# EAGLE design 02_MonitorStage_v1 (EAGLE 9.5.2)

## Sheet 1 of 2
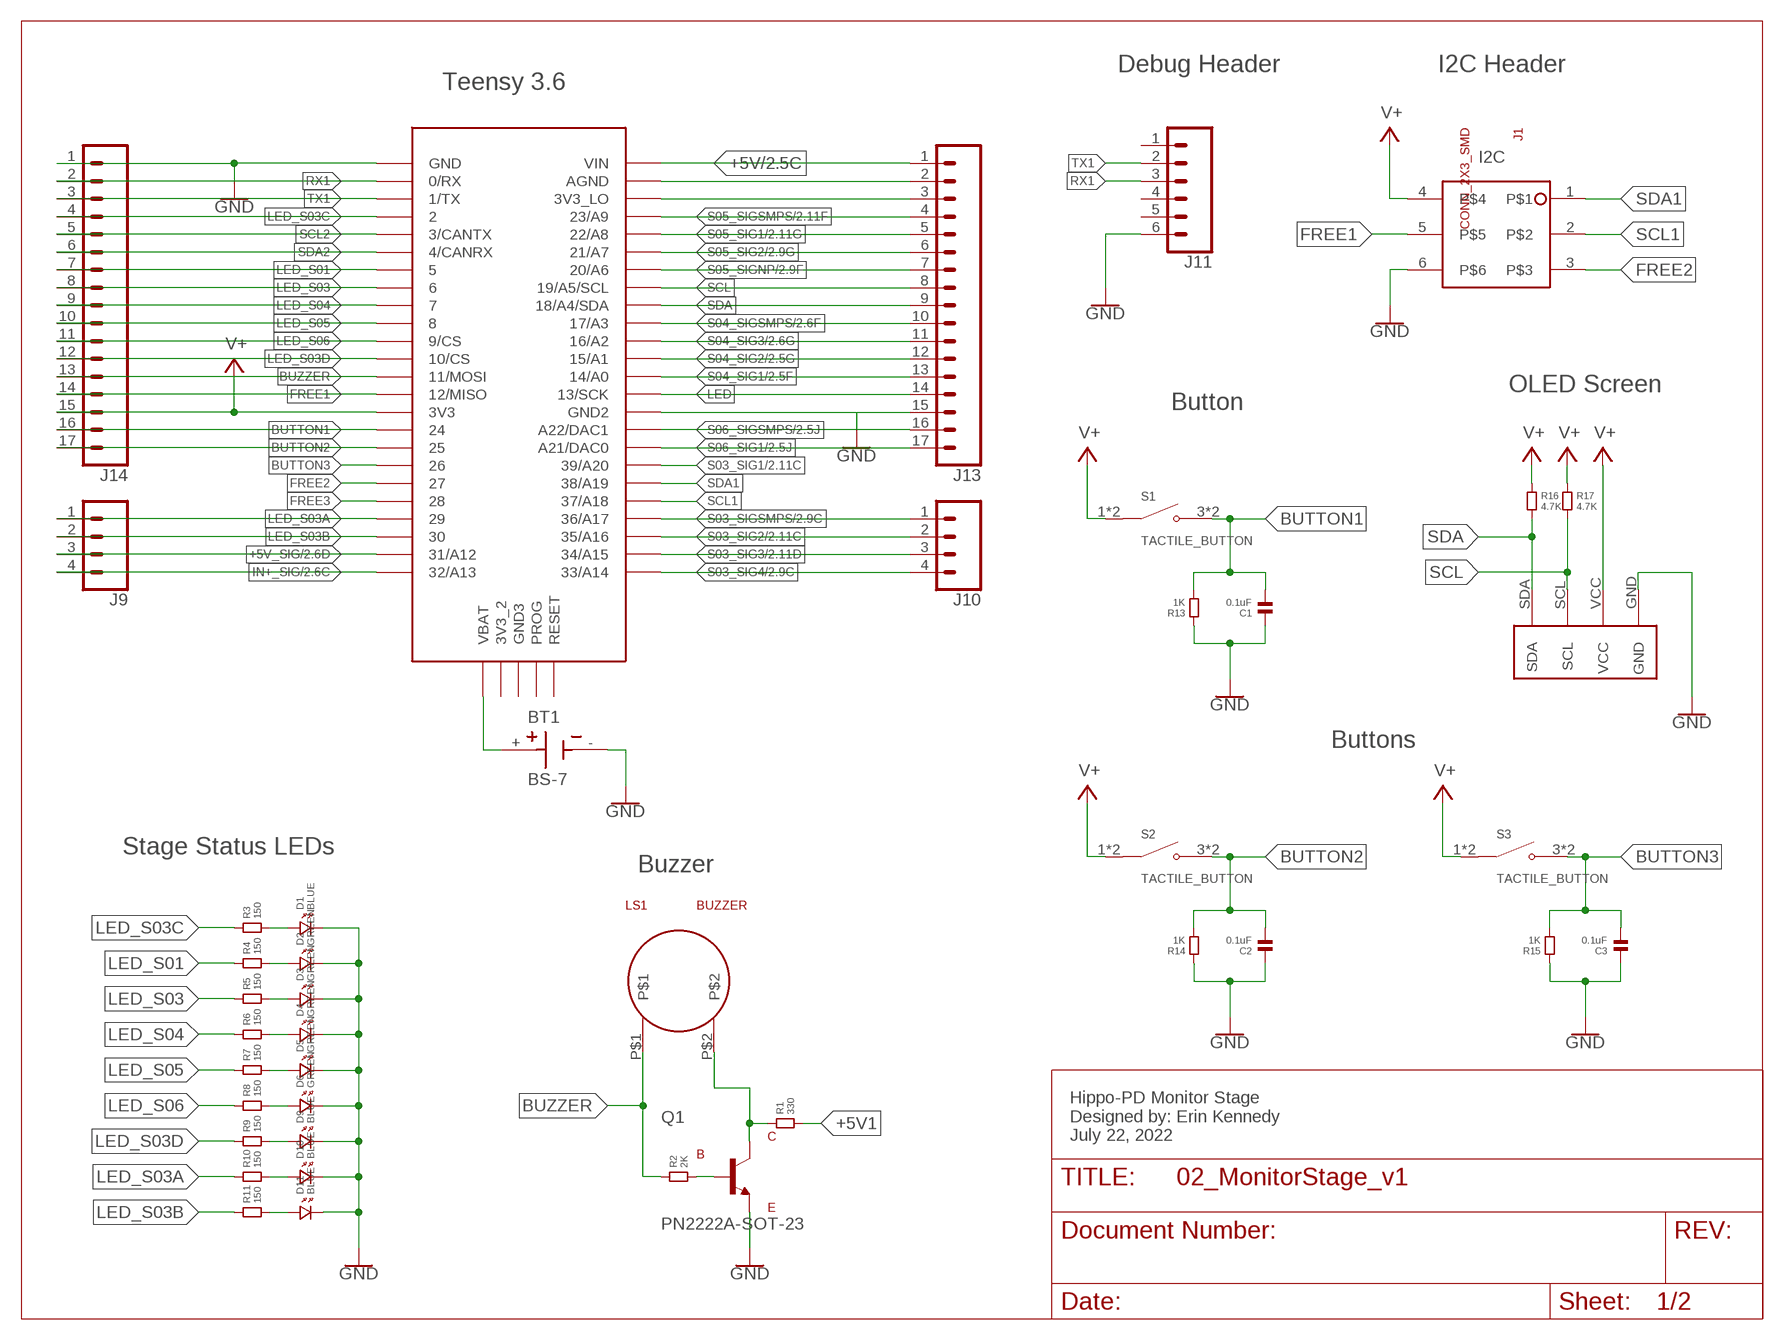
[diagram p0: schematic, sheet 1]

### Parts
BT1  BS-7  [BAT_BS-7]
C1  0.1uF  CAPACITOR.1206  [1206]
C2  0.1uF  CAPACITOR.1206  [1206]
C3  0.1uF  CAPACITOR.1206  [1206]
D1  BLUE  LED.1206  [1206.LED]
D2  GREEN  LED.1206  [1206.LED]
D3  GREEN  LED.1206  [1206.LED]
D4  GREEN  LED.1206  [1206.LED]
D5  GREEN  LED.1206  [1206.LED]
D6  GREEN  LED.1206  [1206.LED]
D9  BLUE  LED.1206  [1206.LED]
D10  BLUE  LED.1206  [1206.LED]
D11  BLUE  LED.1206  [1206.LED]
J1  CONN_2X3_SMD  [2X3_SMD_CONNECTOR]
J9  CONN_04  [1X04]
J10  CONN_04  [1X04]
J11  CONN_06  [1X06-SMD_RA_MALE_NO_HOLES]
J13  CONN_17  [1X17]
J14  CONN_17  [1X17]
LS1  BUZZER  [BUZZER]
Q1  PN2222A-SOT-23  [PN2222A-SOT-23]
R1  330  RESISTOR.1206  [1206]
R2  2K  RESISTOR.1206  [1206]
R3  150  RESISTOR.1206  [1206]
R4  150  RESISTOR.1206  [1206]
R5  150  RESISTOR.1206  [1206]
R6  150  RESISTOR.1206  [1206]
R7  150  RESISTOR.1206  [1206]
R8  150  RESISTOR.1206  [1206]
R9  150  RESISTOR.1206  [1206]
R10  150  RESISTOR.1206  [1206]
R11  150  RESISTOR.1206  [1206]
R13  1K  RESISTOR.1206  [1206]
R14  1K  RESISTOR.1206  [1206]
R15  1K  RESISTOR.1206  [1206]
R16  4.7K  RESISTOR.1206  [1206]
R17  4.7K  RESISTOR.1206  [1206]
S1  TACTILE_BUTTON  [TACTILE_BUTTON]
S2  TACTILE_BUTTON  [TACTILE_BUTTON]
S3  TACTILE_BUTTON  [TACTILE_BUTTON]
U1  TEENSY_3.5/3.6  [TEENSY_3.5/3.6]
U2  TINYSCREEN  [TINYSCREEN]

### Nets
+5V: J13.1 U1.VIN ; also sheet 2
+5V1: R1.2
+5V_SIG: J9.3 U1.31/A12 ; also sheet 2
BUTTON1: C1.2 J14.16 R13.2 S1.3(NO) S1.4(NO) U1.24
BUTTON2: C2.2 J14.17 R14.2 S2.3(NO) S2.4(NO) U1.25
BUTTON3: C3.2 R15.2 S3.3(NO) S3.4(NO) U1.26
BUZZER: J14.13 LS1.P$1 R2.1 U1.11/MOSI
FREE1: J1.5 J14.14 U1.12/MISO
FREE2: J1.3 U1.27
FREE3: U1.28
GND: BT1.- C1.1 C2.1 C3.1 D1.P$2 D2.P$2 D3.P$2 D4.P$2 D5.P$2 D6.P$2 D9.P$2 D10.P$2 D11.P$2 J1.6 J11.6 J13.15 J14.1 Q1.EMITTER R13.1 R14.1 R15.1 U1.GND U1.GND2 U2.GND ; also sheet 2
IN+_SIG: J9.4 U1.32/A13 ; also sheet 2
LED: J13.14 U1.13/SCK
LED_S01: J14.7 R4.1 U1.5
LED_S03: J14.8 R5.1 U1.6
LED_S03A: J9.1 R10.1 U1.29
LED_S03B: J9.2 R11.1 U1.30
LED_S03C: J14.4 R3.1 U1.2
LED_S03D: J14.12 R9.1 U1.10/CS
LED_S04: J14.9 R6.1 U1.7
LED_S05: J14.10 R7.1 U1.8
LED_S06: J14.11 R8.1 U1.9/CS
N$1: BT1.+ U1.VBAT
N$2: D1.P$1 R3.2
N$3: D2.P$1 R4.2
N$4: J13.2 U1.AGND
N$5: D3.P$1 R5.2
N$7: D4.P$1 R6.2
N$8: D5.P$1 R7.2
N$9: D6.P$1 R8.2
N$10: D9.P$1 R9.2
N$11: D10.P$1 R10.2
N$12: D11.P$1 R11.2
N$13: LS1.P$2 Q1.COLLECTOR R1.1
N$14: J13.3 U1.3V3_LO
N$23: Q1.BASE R2.2
RX1: J11.3 J14.2 U1.0/RX
S03_SIG1: U1.39/A20 ; also sheet 2
S03_SIG2: J10.2 U1.35/A16 ; also sheet 2
S03_SIG3: J10.3 U1.34/A15 ; also sheet 2
S03_SIG4: J10.4 U1.33/A14 ; also sheet 2
S03_SIGSMPS: J10.1 U1.36/A17 ; also sheet 2
S04_SIG1: J13.13 U1.14/A0 ; also sheet 2
S04_SIG2: J13.12 U1.15/A1 ; also sheet 2
S04_SIG3: J13.11 U1.16/A2 ; also sheet 2
S04_SIGSMPS: J13.10 U1.17/A3 ; also sheet 2
S05_SIG1: J13.5 U1.22/A8 ; also sheet 2
S05_SIG2: J13.6 U1.21/A7 ; also sheet 2
S05_SIGNP: J13.7 U1.20/A6 ; also sheet 2
S05_SIGSMPS: J13.4 U1.23/A9 ; also sheet 2
S06_SIG1: J13.17 U1.21/DAC0(A21/DAC0) ; also sheet 2
S06_SIGSMPS: J13.16 U1.A22/DAC1 ; also sheet 2
SCL: J13.8 R17.2 U1.19/A5/SCL U2.SCL
SCL1: J1.2 U1.37/A18
SCL2: J14.5 U1.3/CANTX
SDA: J13.9 R16.2 U1.18/A4/SDA U2.SDA
SDA1: J1.1 U1.38/A19
SDA2: J14.6 U1.4/CANRX
TX1: J11.2 J14.3 U1.1/TX
V+: J1.4 J14.15 R16.1 R17.1 S1.1(COM) S1.2(COM) S2.1(COM) S2.2(COM) S3.1(COM) S3.2(COM) U1.3V3 U2.VCC
Unconnected: J11.1 J11.4 J11.5 U1.3V3_2 U1.GND3 U1.PROG U1.RESET

### Notes on the sheet
- Debug Header | I2C Header
- Teensy 3.6
- I2C
- OLED Screen
- Button
- Buttons
- Stage Status LEDs
- Buzzer
- Hippo-PD Monitor Stage
  Designed by: Erin Kennedy
  July 22, 2022

## Sheet 2 of 2
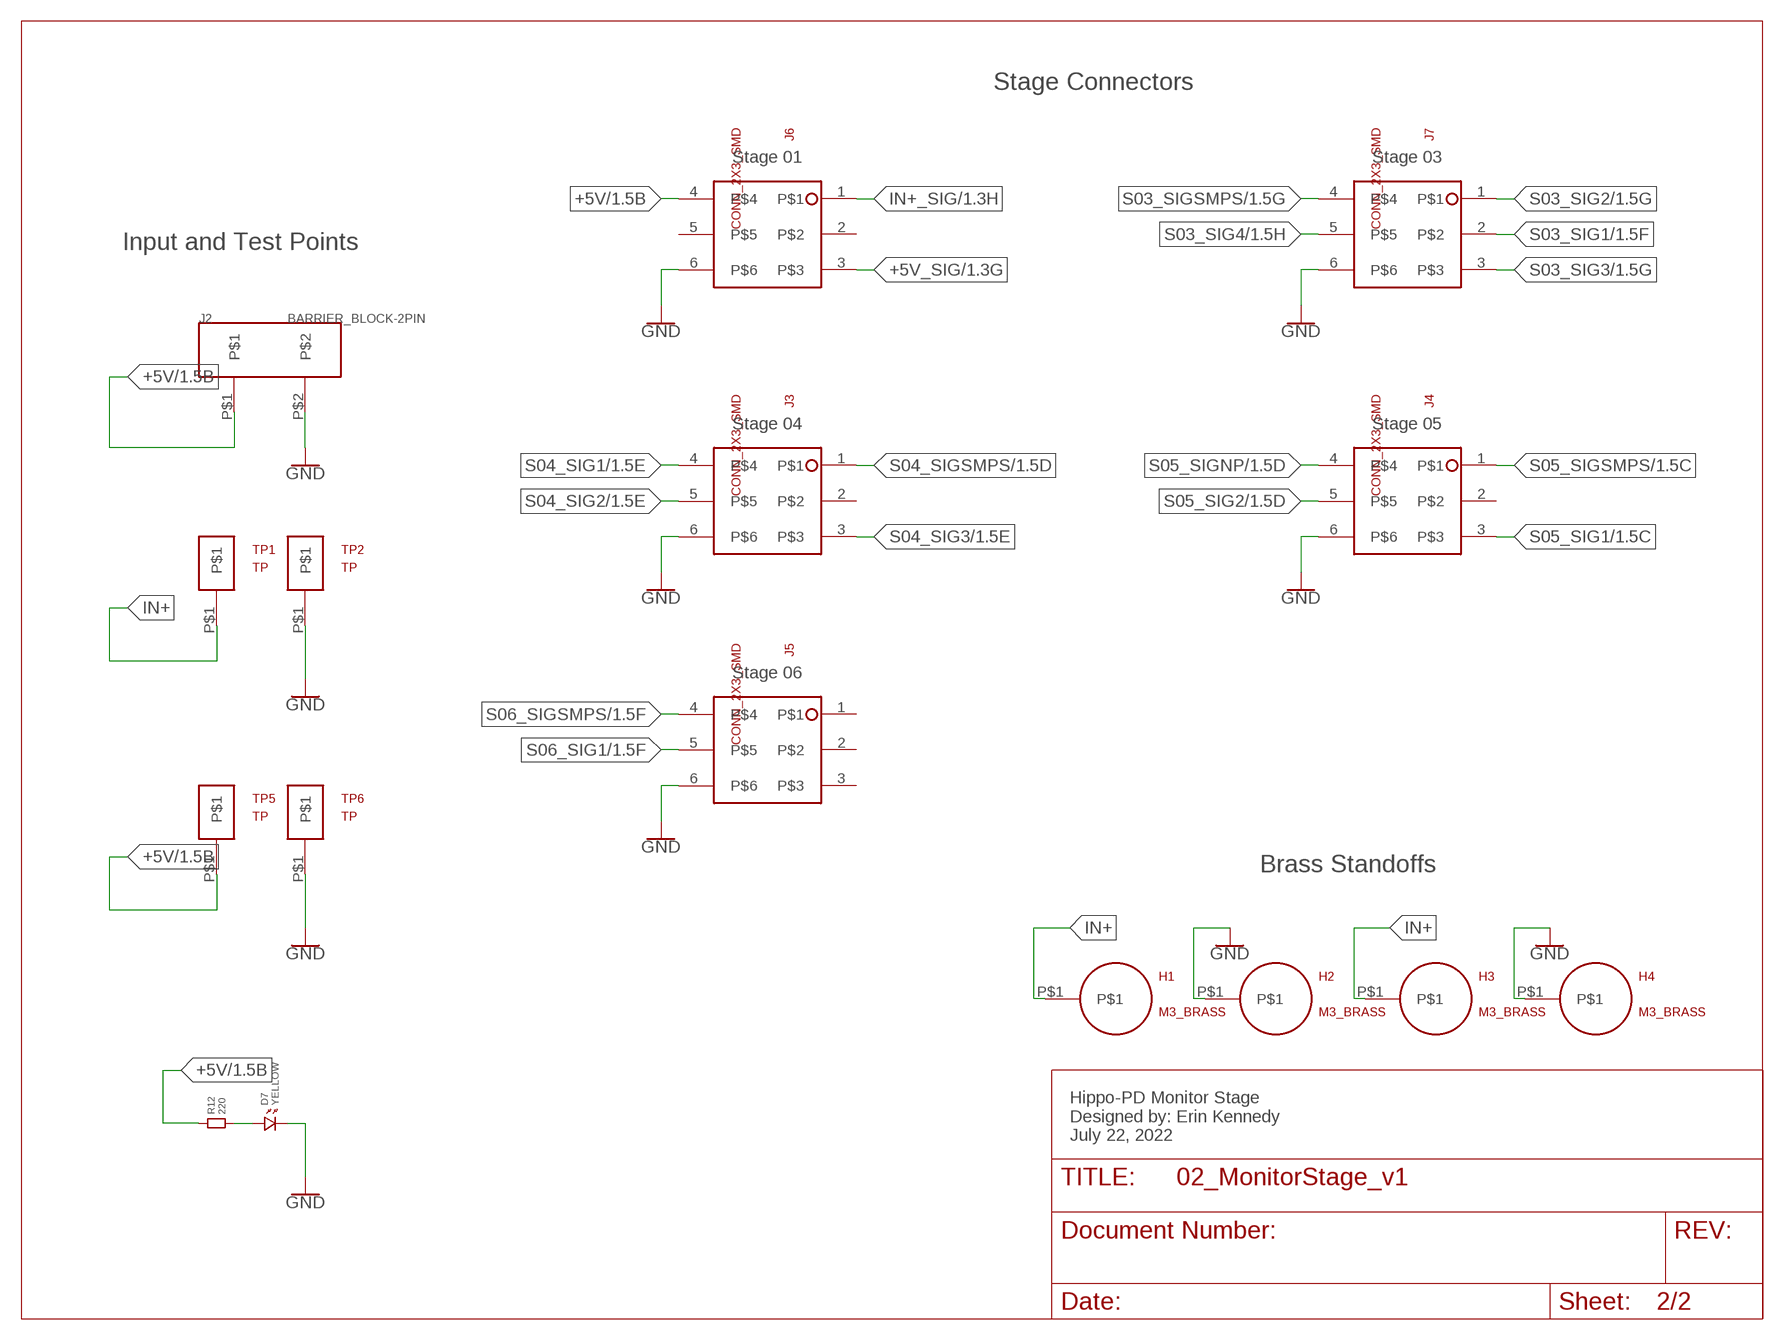
[diagram p1: schematic, sheet 2]

### Parts
D7  YELLOW  LED.1206  [1206.LED]
H1  M3_BRASS  [M3_BRASS]
H2  M3_BRASS  [M3_BRASS]
H3  M3_BRASS  [M3_BRASS]
H4  M3_BRASS  [M3_BRASS]
J2  BARRIER_BLOCK-2PIN  [BARRIERBLOCK-2PIN]
J3  CONN_2X3_SMD  [2X3_SMD_CONNECTOR]
J4  CONN_2X3_SMD  [2X3_SMD_CONNECTOR]
J5  CONN_2X3_SMD  [2X3_SMD_CONNECTOR]
J6  CONN_2X3_SMD  [2X3_SMD_CONNECTOR]
J7  CONN_2X3_SMD  [2X3_SMD_CONNECTOR]
R12  220  RESISTOR.1206  [1206]
TP1  TP  [TP]
TP2  TP  [TP]
TP5  TP  [TP]
TP6  TP  [TP]

### Nets
+5V: J2.P$1 J6.4 R12.1 TP5.P$1 ; also sheet 1
+5V_SIG: J6.3 ; also sheet 1
GND: D7.P$2 H2.P$1 H4.P$1 J2.P$2 J3.6 J4.6 J5.6 J6.6 J7.6 TP2.P$1 TP6.P$1 ; also sheet 1
IN+: H1.P$1 H3.P$1 TP1.P$1
IN+_SIG: J6.1 ; also sheet 1
N$6: D7.P$1 R12.2
S03_SIG1: J7.2 ; also sheet 1
S03_SIG2: J7.1 ; also sheet 1
S03_SIG3: J7.3 ; also sheet 1
S03_SIG4: J7.5 ; also sheet 1
S03_SIGSMPS: J7.4 ; also sheet 1
S04_SIG1: J3.4 ; also sheet 1
S04_SIG2: J3.5 ; also sheet 1
S04_SIG3: J3.3 ; also sheet 1
S04_SIGSMPS: J3.1 ; also sheet 1
S05_SIG1: J4.3 ; also sheet 1
S05_SIG2: J4.5 ; also sheet 1
S05_SIGNP: J4.4 ; also sheet 1
S05_SIGSMPS: J4.1 ; also sheet 1
S06_SIG1: J5.5 ; also sheet 1
S06_SIGSMPS: J5.4 ; also sheet 1
Unconnected: J3.2 J4.2 J5.1 J5.2 J5.3 J6.2 J6.5

### Notes on the sheet
- Stage Connectors
- Stage 01 | Stage 03
- Input and Test Points
- Stage 04 | Stage 05
- Stage 06
- Brass Standoffs
- Hippo-PD Monitor Stage
  Designed by: Erin Kennedy
  July 22, 2022

## Library data of the parts
BT1 = Hippo-PS:BS-7: BATTERY HOLDER COIN 20MM PC PIN Check availability <https://pricing.snapeda.com/parts/BS-7/MPD%20%28Memory/view-part?ref=eda>; AVAILABILITY: In Stock; DESCRIPTION: BATTERY HOLDER COIN 20MM PC PIN; MF: MPD (Memory; MP: BS-7; PACKAGE: None; PRICE: None; PURCHASE-URL: https://pricing.snapeda.com/search/part/BS-7/?ref=eda
C1-C3 = standardparts:CAPACITOR
D1-D7 D9-D11 = standardparts:LED
H1-H4 = Hippo-PS:M3_BRASS
J1 J3-J7 = Hippo-PS:CONN_2X3_SMD
J2 = Hippo-PS:BARRIER_BLOCK-2PIN: Barrier block connector Digikey #ED2946-ND
J9 J10 = SparkFun-Connectors:CONN_04: Multi connection point. Often used as Generic Header-pin footprint for 0.1 inch spaced/style header connections On any of the 0.1 inch spaced packages, you can populate with these: Break Away Headers - Straight <https://www.sparkfun.com/products/116> (PRT-00116) Break Away Male Headers - Right Angle <https://www.sparkfun.com/products/553> (PRT-00553) Female Headers <https://www.sparkfun.com/products/115> (PRT-00115) Break Away Headers - Machine Pin <https://www.sparkfun.com/products/117> (PRT-00117) Break Away Female Headers - Swiss Machine Pin <https://www.sparkfun.com/products/743> (PRT-00743) For SCREWTERMINALS and SPRING TERMINALS visit here: Screw Terimnals on SparkFun.com <https://www.sparkfun.com/search/results?term=Screw+Terminals> (5mm/3.5mm/2.54mm spacing) This device is also useful as a general connection point to wire up your design to another part of your project. Our various solder wires solder well into these plated through hole pads. Hook-Up Wire - Assortment (Stranded, 22 AWG) <https://www.sparkfun.com/products/11375> (PRT-11375) Hook-Up Wire - Assortment (Solid Core, 22 AWG) <https://www.sparkfun.com/products/11367> (PRT-11367) View the entire wire category on our website here <https://www.sparkfun.com/categories/141> Special notes: Molex polarized connector foot print use with SKU : PRT-08231 with associated crimp pins and housings. 1MM SMD Version SKU: PRT-10208; PROD_ID: CONN-09696
J11 = Hippo-PS:CONN_06: Multi connection point. Often used as Generic Header-pin footprint for 0.1 inch spaced/style header connections On any of the 0.1 inch spaced packages, you can populate with these: Break Away Headers - Straight <https://www.sparkfun.com/products/116> (PRT-00116) Break Away Male Headers - Right Angle <https://www.sparkfun.com/products/553> (PRT-00553) Female Headers <https://www.sparkfun.com/products/115> (PRT-00115) Break Away Headers - Machine Pin <https://www.sparkfun.com/products/117> (PRT-00117) Break Away Female Headers - Swiss Machine Pin <https://www.sparkfun.com/products/743> (PRT-00743) Arduino Stackable Header - 6 Pin <https://www.sparkfun.com/products/9280> (PRT-09280) For SCREWTERMINALS and SPRING TERMINALS visit here: Screw Terimnals on SparkFun.com <https://www.sparkfun.com/search/results?term=Screw+Terminals> (5mm/3.5mm/2.54mm spacing) This device is also useful as a general connection point to wire up your design to another part of your project. Our various solder wires solder well into these plated through hole pads. Hook-Up Wire - Assortment (Stranded, 22 AWG) <https://www.sparkfun.com/products/11375> (PRT-11375) Hook-Up Wire - Assortment (Solid Core, 22 AWG) <https://www.sparkfun.com/products/11367> (PRT-11367) View the entire wire category on our website here <https://www.sparkfun.com/categories/141>
J13 J14 = SparkFun-Connectors:CONN_17: Multi connection point. Often used as Generic Header-pin footprint for 0.1 inch spaced/style header connections On any of the 0.1 inch spaced packages, you can populate with these: Break Away Headers - Straight <https://www.sparkfun.com/products/116> (PRT-00116) Break Away Male Headers - Right Angle <https://www.sparkfun.com/products/553> (PRT-00553) Female Headers <https://www.sparkfun.com/products/115> (PRT-00115) Break Away Headers - Machine Pin <https://www.sparkfun.com/products/117> (PRT-00117) Break Away Female Headers - Swiss Machine Pin <https://www.sparkfun.com/products/743> (PRT-00743) For SCREWTERMINALS and SPRING TERMINALS visit here: Screw Terimnals on SparkFun.com <https://www.sparkfun.com/search/results?term=Screw+Terminals> (5mm/3.5mm/2.54mm spacing) This device is also useful as a general connection point to wire up your design to another part of your project. Our various solder wires solder well into these plated through hole pads. Hook-Up Wire - Assortment (Stranded, 22 AWG) <https://www.sparkfun.com/products/11375> (PRT-11375) Hook-Up Wire - Assortment (Solid Core, 22 AWG) <https://www.sparkfun.com/products/11367> (PRT-11367) View the entire wire category on our website here <https://www.sparkfun.com/categories/141> Special notes: Molex polarized connector foot print use with SKU : PRT-08231 with associated crimp pins and housings. 1MM SMD Version SKU: PRT-10208 NOTES ON THE VARIANTS LOCK and LOCK_LONGPADS... This footprint was designed to help hold the alignment of a through-hole component (i.e. 6-pin header) while soldering it into place. You may notice that each hole has been shifted either up or down by 0.005 of an inch from it's more standard position (which is a perfectly straight line). This slight alteration caused the pins (the squares in the middle) to touch the edges of the holes. Because they are alternating, it causes a "brace" to hold the component in place. 0.005 has proven to be the perfect amount of "off-center" position when using our standard breakaway headers. Although looks a little odd when you look at the bare footprint, once you have a header in there, the alteration is very hard to notice. Also,if you push a header all the way into place, it is covered up entirely on the bottom side.
LS1 = Hippo-PS:BUZZER
Q1 = Hippo-PS:PN2222A-SOT-23: MMBT3904 series 40V 200mA SOT23 NPN Switching Transistor Check availability <https://pricing.snapeda.com/parts/MMBT3904%2C215/Nexperia%20USA/view-part?ref=eda>; AVAILABILITY: In Stock; DESCRIPTION: Bipolar (BJT) Transistor NPN 40 V 200 mA 300MHz 250 mW Surface Mount TO-236AB; MF: Nexperia USA; MP: MMBT3904,215; PACKAGE: SOT23-3 Nexperia USA Inc.; PRICE: None; PURCHASE-URL: https://pricing.snapeda.com/search/part/MMBT3904,215/?ref=eda
R1-R17 = standardparts:RESISTOR
S1-S3 = Hippo-PS:TACTILE_BUTTON: Tactile Switch SPST-NO Top Actuated Surface Mount Check availability <https://pricing.snapeda.com/parts/PTS526%20SM08%20SMTR2%20LFS/C%26K/view-part?ref=eda>; AVAILABILITY: In Stock; DESCRIPTION: Tactile Switch SPST-NO Top Actuated Surface Mount; MF: C&K; MP: PTS526 SM08 SMTR2 LFS; PACKAGE: None; PRICE: None; PURCHASE-URL: https://pricing.snapeda.com/search/part/PTS526 SM08 SMTR2 LFS/?ref=eda
TP1 TP2 TP5 TP6 = Hippo-PS:TP
U1 = Hippo-PS:TEENSY_3.5/3.6
U2 = Hippo-PS:TINYSCREEN

## Board
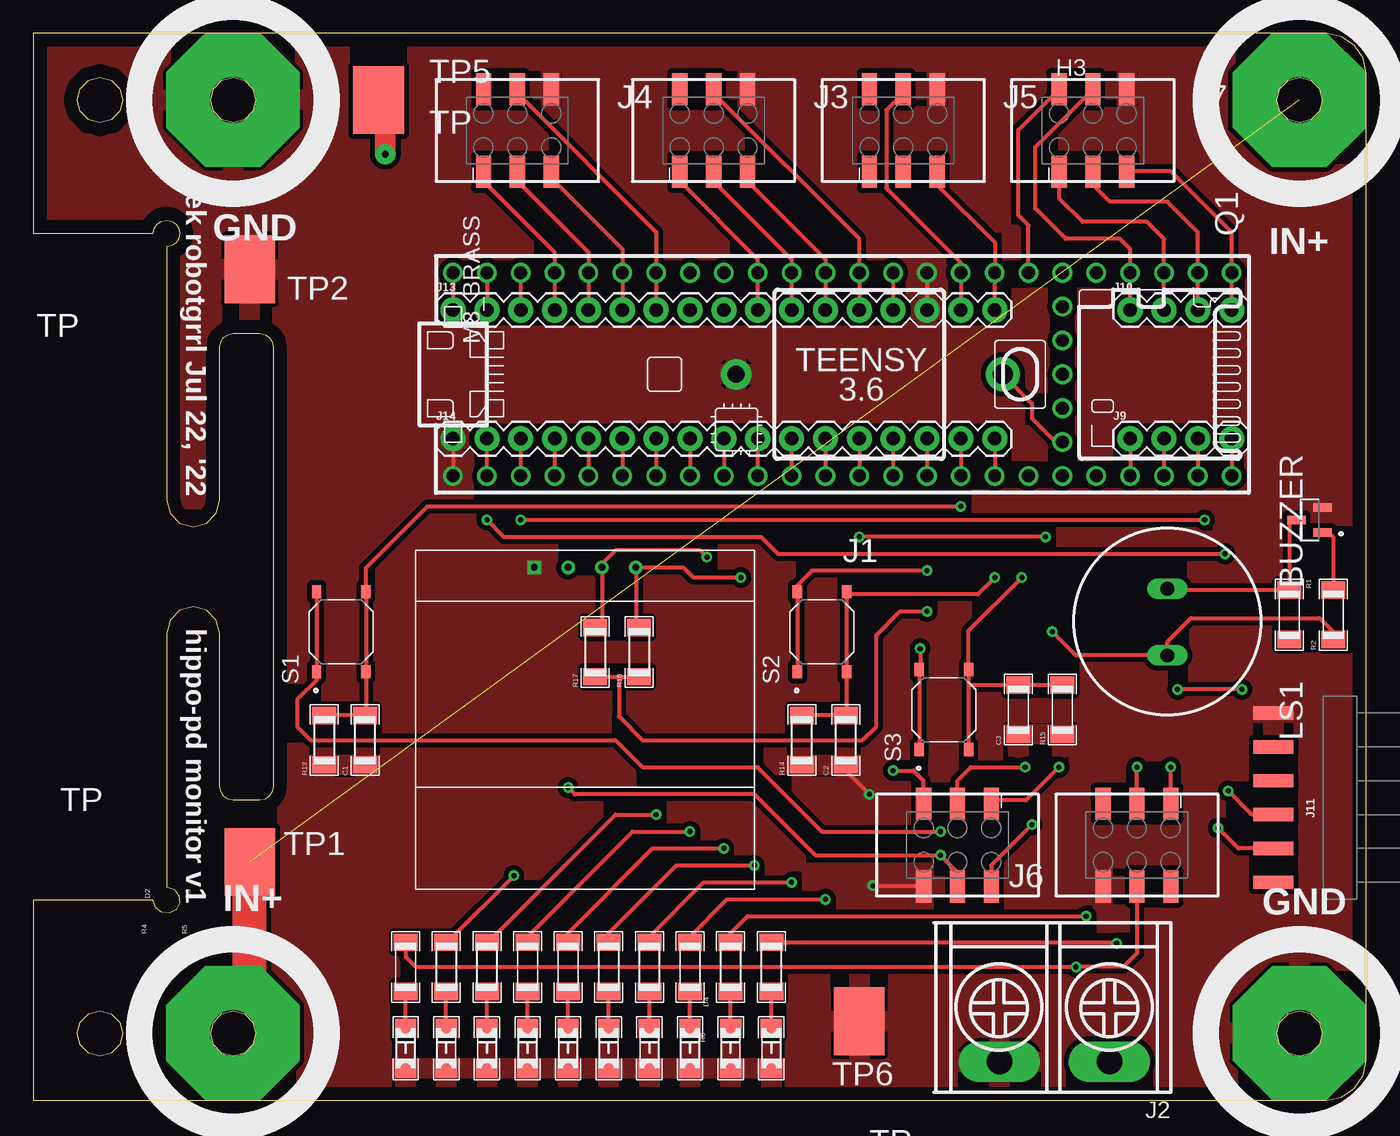
[diagram p2: board, top side]
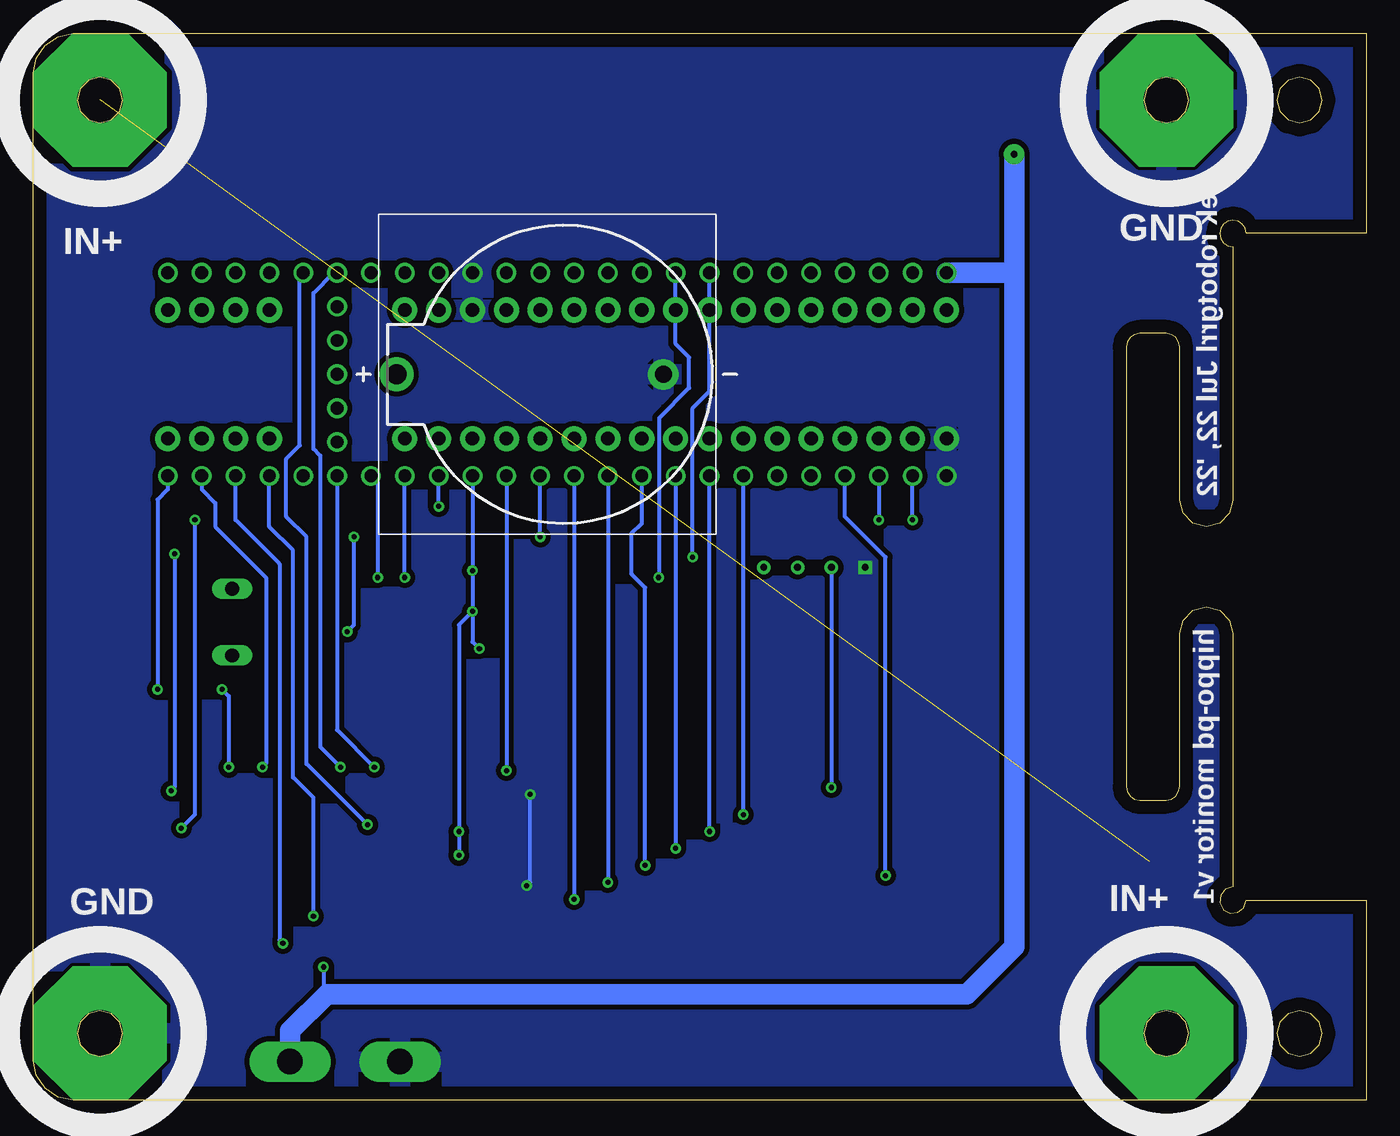
[diagram p3: board, bottom side, seen from below]

Size 100 x 80 mm. Coordinates in mm from the lower left corner, seen from the top.
Outline: 100,77 99.77,78.15 99.12,79.12 98.15,79.77 97,80 0,80 0,65 9,65 9.08,65.39 9.29,65.71 9.61,65.92 10,66 10.39,65.92 10.71,65.71 10.92,65.39 11,65 10.92,64.61 10.71,64.29 10.39,64.08 10,64 10,45 10.27,44 11,43.27 12,43 13,43.27 13.73,44 14,45 14,56.5 14.08,56.89 14.29,57.21 14.61,57.42 15,57.5 17,57.5 17.39,57.42 17.71,57.21 17.92,56.89 18,56.5 18,23.5 17.92,23.11 17.71,22.79 17.39,22.58 17,22.5 15,22.5 14.61,22.58 14.29,22.79 14.08,23.11 14,23.5 14,35 13.73,36 13,36.73 12,37 11,36.73 10.27,36 10,35 10,16 10.56,15.83 10.92,15.38 10.98,14.8 10.71,14.29 10.2,14.02 9.62,14.08 9.17,14.44 9,15 0,15 0,0 97,0 98.15,0.23 99.12,0.88 99.77,1.85 100,3 100,77
Outline: 6.7,75 6.47,74.15 5.85,73.53 5,73.3 4.15,73.53 3.53,74.15 3.3,75 3.53,75.85 4.15,76.47 5,76.7 5.85,76.47 6.47,75.85 6.7,75
Outline: 96.7,75 96.47,74.15 95.85,73.53 95,73.3 94.15,73.53 93.53,74.15 93.3,75 93.53,75.85 94.15,76.47 95,76.7 95.85,76.47 96.47,75.85 96.7,75
Outline: 96.7,5 96.47,4.15 95.85,3.53 95,3.3 94.15,3.53 93.53,4.15 93.3,5 93.53,5.85 94.15,6.47 95,6.7 95.85,6.47 96.47,5.85 96.7,5
Outline: 16.7,75 16.47,74.15 15.85,73.53 15,73.3 14.15,73.53 13.53,74.15 13.3,75 13.53,75.85 14.15,76.47 15,76.7 15.85,76.47 16.47,75.85 16.7,75
Outline: 16.7,5 16.47,4.15 15.85,3.53 15,3.3 14.15,3.53 13.53,4.15 13.3,5 13.53,5.85 14.15,6.47 15,6.7 15.85,6.47 16.47,5.85 16.7,5
Outline: 6.7,5 6.47,4.15 5.85,3.53 5,3.3 4.15,3.53 3.53,4.15 3.3,5 3.53,5.85 4.15,6.47 5,6.7 5.85,6.47 6.47,5.85 6.7,5
Copper layers (1*16): Top 0.035mm / dielectric 1.5mm / Bottom 0.035mm
Design rules "default": minimum track width 6mil, minimum drill 0.35mm, track to track 6mil, track to pad 6mil, pad to pad 6mil, via to via 6mil, smd to smd 6mil, copper to edge 40mil, drill to drill 6mil, minimum pad ring 10mil, minimum via ring 8mil, stop-mask expansion 4mil, vias tented up to drill 0mil, thermal gap 10mil

### Footprints (pad centres in the part's own frame; a part is rotated, then mirrored left to right if it is on the bottom)
BAT_BS-7 = drill 1.5 pad 2.54: + 10,0 | drill 1.27 pad 2.286: - -10,0
1206 = smd 1.3 x 1.8: 1 -1.85,0; 2 1.85,0
1206.LED = smd 1.4 x 1.6: P$1 -1.5,0; P$2 1.5,0
M3_BRASS = drill 3.4 pad 10 octagon: P$1 0,0
2X3_SMD_CONNECTOR = smd 1.147 x 2.408: 1 -2.54,-3.104; 2 -2.54,3.104; 3 0,-3.104; 4 0,3.104; 5 2.54,-3.104; 6 2.54,3.104
BARRIERBLOCK-2PIN = drill 1.905 pad 3.048 long: P$1 4.6,10.4; P$2 12.85,10.4
1X04 = drill 1.016 pad 1.88: 1 0,0; 2 2.54,0; 3 5.08,0; 4 7.62,0
1X06-SMD_RA_MALE_NO_HOLES = smd 1 x 3: 1 -6.35,5; 2 -3.81,5; 3 -1.27,5; 4 1.27,5; 5 3.81,5; 6 6.35,5
1X17 = drill 1.016 pad 1.88: 1 0,0; 2 2.54,0; 3 5.08,0; 4 7.62,0; 5 10.16,0; 6 12.7,0; 7 15.24,0; 8 17.78,0; 9 20.32,0; 10 22.86,0; 11 25.4,0; 12 27.94,0; 13 30.48,0; 14 33.02,0; 15 35.56,0; 16 38.1,0; 17 40.64,0
BUZZER = drill 1.016 long: P$1 -2.54,0; P$2 2.46,0
PN2222A-SOT-23 = smd 0.635 x 1.397: BASE -0.95,-0.98; COLLECTOR 0,0.98; EMITTER 0.95,-0.98
TACTILE_BUTTON = smd 1 x 0.7: 1 -3,1.85; 2 3,1.85; 3 -3,-1.85; 4 3,-1.85
TP = smd 3.81 x 5.08: P$1 0,0
TEENSY_3.5/3.6 = drill 0.965: 0/RX -25.4,-7.62; 1/TX -22.86,-7.62; 2 -20.32,-7.62; 3/CANTX -17.78,-7.62; 3V3 7.62,-7.62; 3V3_2 17.78,-2.54; 3V3_LO -22.86,7.62; 4/CANRX -15.24,-7.62; 5 -12.7,-7.62; 6 -10.16,-7.62; 7 -7.62,-7.62; 8 -5.08,-7.62; 9/CS -2.54,-7.62; 10/CS 0,-7.62; 11/MOSI 2.54,-7.62; 12/MISO 5.08,-7.62; 13/SCK 5.08,7.62; 14/A0 2.54,7.62; 15/A1 0,7.62; 16/A2 -2.54,7.62; 17/A3 -5.08,7.62; 18/A4/SDA -7.62,7.62; 19/A5/SCL -10.16,7.62; 20/A6 -12.7,7.62; 21/A7 -15.24,7.62; 21/DAC0 12.7,7.62; 22/A8 -17.78,7.62; 23/A9 -20.32,7.62; 24 10.16,-7.62; 25 12.7,-7.62; 26 15.24,-7.62; 27 17.78,-7.62; 28 20.32,-7.62; 29 22.86,-7.62; 30 25.4,-7.62; 31/A12 27.94,-7.62; 32/A13 30.48,-7.62; 33/A14 30.48,7.62; 34/A15 27.94,7.62; 35/A16 25.4,7.62; 36/A17 22.86,7.62; 37/A18 20.32,7.62; 38/A19 17.78,7.62; 39/A20 15.24,7.62; A22/DAC1 10.16,7.62; AGND -25.4,7.62; GND -27.94,-7.62; GND2 7.62,7.62; GND3 17.78,0; PROG 17.78,2.54; RESET 17.78,5.08; VBAT 17.78,-5.08; VIN -27.94,7.62
TINYSCREEN = drill 0.508 pad 1.016 square: GND 8.89,24.13 | drill 0.508 pad 1.016: SCL 13.97,24.13; SDA 16.51,24.13; VCC 11.43,24.13

### Placement (x,y rotation side)
BT1  62.73,54.44 180 bottom
C1  24.88,27 90 top
C2  60.95,27 90 top
C3  73.91,29.29 90 top
D1  30.98,3.89 270 top
D2  34.03,3.89 270 top
D3  37.08,3.89 270 top
D4  40.12,3.89 270 top
D5  43.17,3.89 270 top
D6  46.22,3.89 270 top
D7  27.93,3.89 270 top
D9  49.27,3.89 270 top
D10  52.32,3.89 270 top
D11  55.36,3.89 270 top
H1  14.98,5.03 0 top
H2  94.99,5.03 0 top
H3  94.99,75.01 0 top
H4  14.98,75.01 0 top
J1  69.33,19.13 180 top
J2  85.34,13.29 180 top
J3  51.05,72.72 0 top
J4  36.31,72.72 0 top
J5  65.27,72.72 0 top
J6  82.8,19.13 180 top
J7  79.49,72.72 0 top
J9  82.29,49.61 0 top
J10  82.29,59.26 0 top
J11  98.04,22.69 90 top
J13  31.49,59.26 0 top
J14  31.49,49.61 0 top
LS1  85.08,35.89 90 top
Q1  95.75,43.51 90 top
R1  94.23,36.4 270 top
R2  97.53,36.4 90 top
R3  30.98,9.99 270 top
R4  34.03,9.99 270 top
R5  37.08,9.99 270 top
R6  40.12,9.99 270 top
R7  43.17,9.99 270 top
R8  46.22,9.99 270 top
R9  49.27,9.99 270 top
R10  52.32,9.99 270 top
R11  55.36,9.99 270 top
R12  27.93,9.99 270 top
R13  21.84,27 90 top
R14  57.65,27 90 top
R15  77.21,29.29 90 top
R16  45.46,33.61 90 top
R17  42.16,33.61 90 top
S1  23.11,35.13 90 top
S2  59.17,35.13 90 top
S3  68.32,29.29 90 top
TP1  16.25,17.86 0 top
TP2  16.25,62.31 0 top
TP5  25.9,75.01 0 top
TP6  61.97,5.92 0 top
U1  59.43,54.44 0 top
U2  28.69,15.83 0 top

### Tracks (layer width: path | path; a pad name or v marks a point on that pad's centre or on a via)
+5V  (via drill 0.38 pad 0.64, 0.51 pad 1.52)
  Top 0.305: R12.1 27.93,10.75 28.69,9.99 v78.22,9.99 81.78,9.99 82.8,11 J6.4 | U1.VIN J13.1
  Top 1.524: v26.41,70.95 26.41,74.5 TP5.P$1
  Bottom 0.305: v78.22,9.99 78.22,8.21 77.97,7.95
  Bottom 1.524: J2.P$1 80.74,5.19 77.97,7.95 29.96,7.95 26.41,11.51 26.41,62.06 | 26.41,62.06 U1.VIN | 26.41,62.06 v26.41,70.95
+5V_SIG  (via drill 0.38 pad 0.64)
  Top 0.305: J6.3 v82.8,24.97 | J9.3 U1.31/A12
  Bottom 0.305: U1.31/A12 87.37,45.8 86.35,44.78 86.35,43.01 82.54,39.2 82.54,25.23 v82.8,24.97
BUTTON1  (via drill 0.38 pad 0.64)
  Top 0.305: R13.2 C1.2 24.96,28.93 S1.3 S1.4 24.96,39.91 29.58,44.53 v69.59,44.53 | J14.16 U1.24
  Bottom 0.305: v69.59,44.53 U1.24
BUTTON2  (via drill 0.38 pad 0.64)
  Top 0.305: R14.2 C2.2 61.02,28.93 S2.3 S2.4 61.23,37.93 70.86,37.93 v72.13,39.2 | J14.17 U1.25
  Bottom 0.305: v72.13,39.2 U1.25
BUTTON3  (via drill 0.38 pad 0.64)
  Top 0.305: 70.17,31.07 S3.4 70.17,35.2 v74.16,39.2 | 70.17,31.07 S3.3 | 70.17,31.07 70.24,31.14 C3.2 R15.2
  Bottom 0.305: v74.16,39.2 74.16,46.31 U1.26
BUZZER  (via drill 0.38 pad 0.64)
  Top 0.305: R2.1 97.53,35.13 96.51,36.15 86.86,36.15 85.08,34.37 LS1.P$1 78.22,33.35 v76.45,35.13 | v75.94,42.24 v61.97,42.24 | J14.13 U1.11/MOSI
  Bottom 0.305: v76.45,35.13 75.94,35.64 v75.94,42.24 | v61.97,42.24 U1.11/MOSI
FREE1  (via drill 0.38 pad 0.64)
  Top 0.305: v64.51,24.72 66.03,24.72 66.79,23.96 J1.5 | J14.14 U1.12/MISO
  Bottom 0.305: U1.12/MISO v64.51,24.72
FREE2  (via drill 0.38 pad 0.64)
  Top 0.305: v74.41,24.97 70.35,24.97 69.33,23.96 J1.3
  Bottom 0.305: U1.27 77.21,27.77 v74.41,24.97
GND  (via drill 0.38 pad 0.64)
  Top 0.305: J1.6 63.04,16.03 v62.98,16.08 | v62.73,22.94 60.95,24.72 C2.1 | J14.1 U1.GND | U1.GND2 J13.15
  Bottom 0.305: v62.98,16.08 62.73,16.34 v62.73,22.94
  pour Top (isolate 0.381): -4.33,85.68 109.47,85.68 109.47,-7.03 -6.36,-7.03 -6.36,85.68
  pour Bottom (isolate 0.381): -6.36,87.46 111.5,87.46 111.5,-9.06 -8.64,-9.06 -8.64,87.46
IN+  (1 unrouted)
  Top 2.54: H1.P$1 16.25,6.3 TP1.P$1
IN+_SIG  (via drill 0.38 pad 0.64)
  Top 0.305: v90.67,30.81 v85.84,30.81 | J6.1 v85.34,24.97 | J9.4 U1.32/A13
  Bottom 0.305: U1.32/A13 89.91,45.8 90.67,45.04 v90.67,30.81 | v85.84,30.81 85.34,30.31 v85.34,24.97
LED
  Top 0.305: U1.13/SCK J13.14
LED_S01  (via drill 0.38 pad 0.64)
  Top 0.305: v46.73,21.42 43.68,21.42 34.1,11.84 R4.1 | J14.7 U1.5
  Bottom 0.305: v46.73,21.42 U1.5
LED_S03  (via drill 0.38 pad 0.64)
  Top 0.305: R5.1 37.08,12.27 44.95,20.15 v49.27,20.15 | J14.8 U1.6
  Bottom 0.305: v49.27,20.15 U1.6
LED_S03A  (via drill 0.38 pad 0.64)
  Top 0.305: R10.1 52.32,12.53 53.59,13.8 v78.99,13.8 | J9.1 U1.29
  Bottom 0.305: v78.99,13.8 78.99,22.69 80.51,24.21 80.51,41.23 82.29,43.01 U1.29
LED_S03B  (via drill 0.38 pad 0.64)
  Top 0.305: R11.1 81.2,11.84 v81.27,11.76 | J9.2 U1.30
  Bottom 0.305: v81.27,11.76 81.53,12.02 81.53,40.21 84.83,43.51 U1.30
LED_S03C  (via drill 0.38 pad 0.64)
  Top 0.305: v36.06,16.84 31.05,11.84 R3.1 | J14.4 U1.2
  Bottom 0.305: v36.06,16.84 36.06,40.72 39.11,43.77 U1.2
LED_S03D  (via drill 0.38 pad 0.64)
  Top 0.305: R9.1 49.27,12.27 52.06,15.07 v59.43,15.07 | J14.12 U1.10/CS
  Bottom 0.305: U1.10/CS v59.43,15.07
LED_S04  (via drill 0.38 pad 0.64)
  Top 0.305: R6.1 40.12,12.53 46.47,18.88 v51.81,18.88 | J14.9 U1.7
  Bottom 0.305: U1.7 v51.81,18.88
LED_S05  (via drill 0.38 pad 0.64)
  Top 0.305: R7.1 43.17,12.53 48.25,17.61 v54.09,17.61 | J14.10 U1.8
  Bottom 0.305: v54.09,17.61 54.09,38.43 55.11,39.45 55.11,42.5 54.35,43.26 U1.8
LED_S06  (via drill 0.38 pad 0.64)
  Top 0.305: R8.1 46.22,12.27 50.28,16.34 v56.89,16.34 | J14.11 U1.9/CS
  Bottom 0.305: U1.9/CS v56.89,16.34
N$1
  Top 0.305: BT1.+ 74.92,52.24 74.92,51.13 76.7,49.36 U1.VBAT
N$2
  Top 0.305: D1.P$1 R3.2
N$3
  Top 0.305: D2.P$1 R4.2
N$4
  Top 0.305: U1.AGND J13.2
N$5
  Top 0.305: D3.P$1 R5.2
N$6
  Top 0.305: D7.P$1 R12.2
N$7
  Top 0.305: D4.P$1 R6.2
N$8
  Top 0.305: D5.P$1 R7.2
N$9
  Top 0.305: D6.P$1 R8.2
N$10
  Top 0.305: D9.P$1 R9.2
N$11
  Top 0.305: D10.P$1 R10.2
N$12
  Top 0.305: D11.P$1 R11.2
N$13
  Top 0.305: LS1.P$2 85.18,38.25 R1.1 94.23,43.51 Q1.COLLECTOR
N$14
  Top 0.305: U1.3V3_LO J13.3
N$23
  Top 0.305: Q1.BASE 97.21,42.56 97.53,42.24 R2.2
RX1  (via drill 0.38 pad 0.64)
  Top 0.305: v89.65,23.19 91.43,21.42 J11.3 | v34.03,43.51 35.3,42.24 54.6,42.24 55.87,40.97 v89.4,40.97 | U1.0/RX J14.2
  Bottom 0.305: v89.4,40.97 89.4,23.45 v89.65,23.19 | v34.03,43.51 U1.0/RX
S03_SIG1
  Top 0.305: U1.39/A20 74.67,65.61 73.91,66.37 73.91,72.72 76.95,75.77 J7.2
S03_SIG2
  Top 0.305: J7.1 76.95,67.64 78.73,65.87 83.56,65.87 84.83,64.6 U1.35/A16 J10.2
S03_SIG3
  Top 0.305: J7.3 79.75,69.37 79.75,68.41 80.76,67.39 85.08,67.39 87.37,65.1 U1.34/A15 J10.3
S03_SIG4
  Top 0.305: J7.5 82.09,69.68 85.34,69.68 89.91,65.1 U1.33/A14 J10.4
S03_SIGSMPS
  Top 0.305: J7.4 79.49,75.77 75.18,71.45 75.18,66.88 77.46,64.6 81.53,64.6 82.29,63.83 U1.36/A17 J10.1
S04_SIG1
  Top 0.305: J3.4 51.05,75.52 61.97,64.6 U1.14/A0 J13.13
S04_SIG2
  Top 0.305: J3.5 53.59,68.91 59.43,63.07 U1.15/A1 J13.12
S04_SIG3
  Top 0.305: J3.3 51.05,68.91 56.89,63.07 U1.16/A2 J13.11
S04_SIGSMPS
  Top 0.305: J3.1 48.51,68.91 54.35,63.07 U1.17/A3 J13.10
S05_SIG1
  Top 0.305: J4.3 36.31,68.91 41.65,63.58 U1.22/A8 J13.5
S05_SIG2
  Top 0.305: J4.5 38.85,69.17 44.19,63.83 U1.21/A7 J13.6
S05_SIGNP
  Top 0.305: J4.4 36.31,75.52 46.73,65.1 U1.20/A6 J13.7
S05_SIGSMPS
  Top 0.305: J4.1 34.03,69.37 34.03,68.66 39.11,63.58 U1.23/A9 J13.4
S06_SIG1
  Top 0.305: J5.5 67.81,68.66 72.13,64.34 U1.21/DAC0 J13.17
S06_SIGSMPS
  Top 0.305: J5.4 65.27,75.52 64,74.25 64,68.41 69.59,62.82 U1.A22/DAC1 J13.16
SCL  (via drill 0.38 pad 0.64)
  Top 0.305: v50.54,40.72 50.03,41.23 43.68,41.23 42.66,40.21 U2.SCL 42.66,35.89 42.23,35.46 R17.2
  Bottom 0.305: v50.54,40.72 50.54,51.9 49.27,53.17 J13.8 U1.19/A5/SCL
SCL1  (via drill 0.38 pad 0.64)
  Top 0.305: v74.92,20.65 71.87,17.61 J1.2
  Bottom 0.305: U1.37/A18 80,61.8 80,49.1 81.02,48.09 81.02,43.77 79.49,42.24 79.49,25.23 v74.92,20.65
SCL2
  Top 0.305: J14.5 U1.3/CANTX
SDA  (via drill 0.38 pad 0.64)
  Top 0.305: v53.08,39.2 49.52,39.2 48.76,39.96 U2.SDA 45.2,35.71 R16.2
  Bottom 0.305: v53.08,39.2 53.05,39.22 53.05,51.16 50.79,53.42 50.79,55.71 51.81,56.72 J13.9 U1.18/A4/SDA
SDA1  (via drill 0.38 pad 0.64)
  Top 0.305: v76.95,24.97 74.47,22.49 72.13,22.49 J1.1
  Bottom 0.305: v76.95,24.97 78.48,26.5 78.48,48.34 78.99,48.85 78.99,60.53 77.46,62.06 U1.38/A19
SDA2
  Top 0.305: J14.6 U1.4/CANRX
TX1  (via drill 0.38 pad 0.64)
  Top 0.305: v36.57,43.51 v87.88,43.51 | J11.2 90.42,18.88 v88.89,20.4 | J14.3 U1.1/TX
  Bottom 0.305: U1.1/TX v36.57,43.51 | v87.88,43.51 87.88,21.42 v88.89,20.4
V+  (via drill 0.38 pad 0.64)
  Top 0.305: v66.54,33.86 66.54,32.36 S3.2 S3.1 | v67.05,39.7 58.41,39.7 57.32,38.62 S2.2 S2.1 | J1.4 69.33,17.1 v68.06,18.37 58.67,18.37 54.09,22.94 40.63,22.94 v40.12,23.45 | S1.2 S1.1 21.26,31.5 19.8,30.05 19.8,28.02 20.82,27 43.68,27 45.71,24.97 54.35,24.97 59.17,20.15 v68.06,20.15 | R17.1 43.93,31.76 | 43.93,31.76 R16.1 | 43.93,31.76 43.93,28.78 45.71,27 62.22,27 63.24,28.02 63.24,34.88 65.02,36.66 v67.05,36.66 | J14.15 U1.3V3
  Bottom 0.305: U1.3V3 v67.05,39.7 v67.05,36.66 | v67.05,36.66 67.05,34.37 v66.54,33.86 | v67.05,36.66 68.06,35.64 v68.06,20.15 v68.06,18.37 | U2.VCC v40.12,23.45

### Text on the board
tPlace: ek robotgrrl Jul 22, '22 | GND | IN+ | hippo-pd monitor v1 | IN+ | GND
bPlace: ek robotgrrl Jul 22, '22 | GND | IN+ | hippo-pd monitor v1 | IN+ | GND
tNames: word